# EAGLE design stickie (EAGLE 7.3.0)
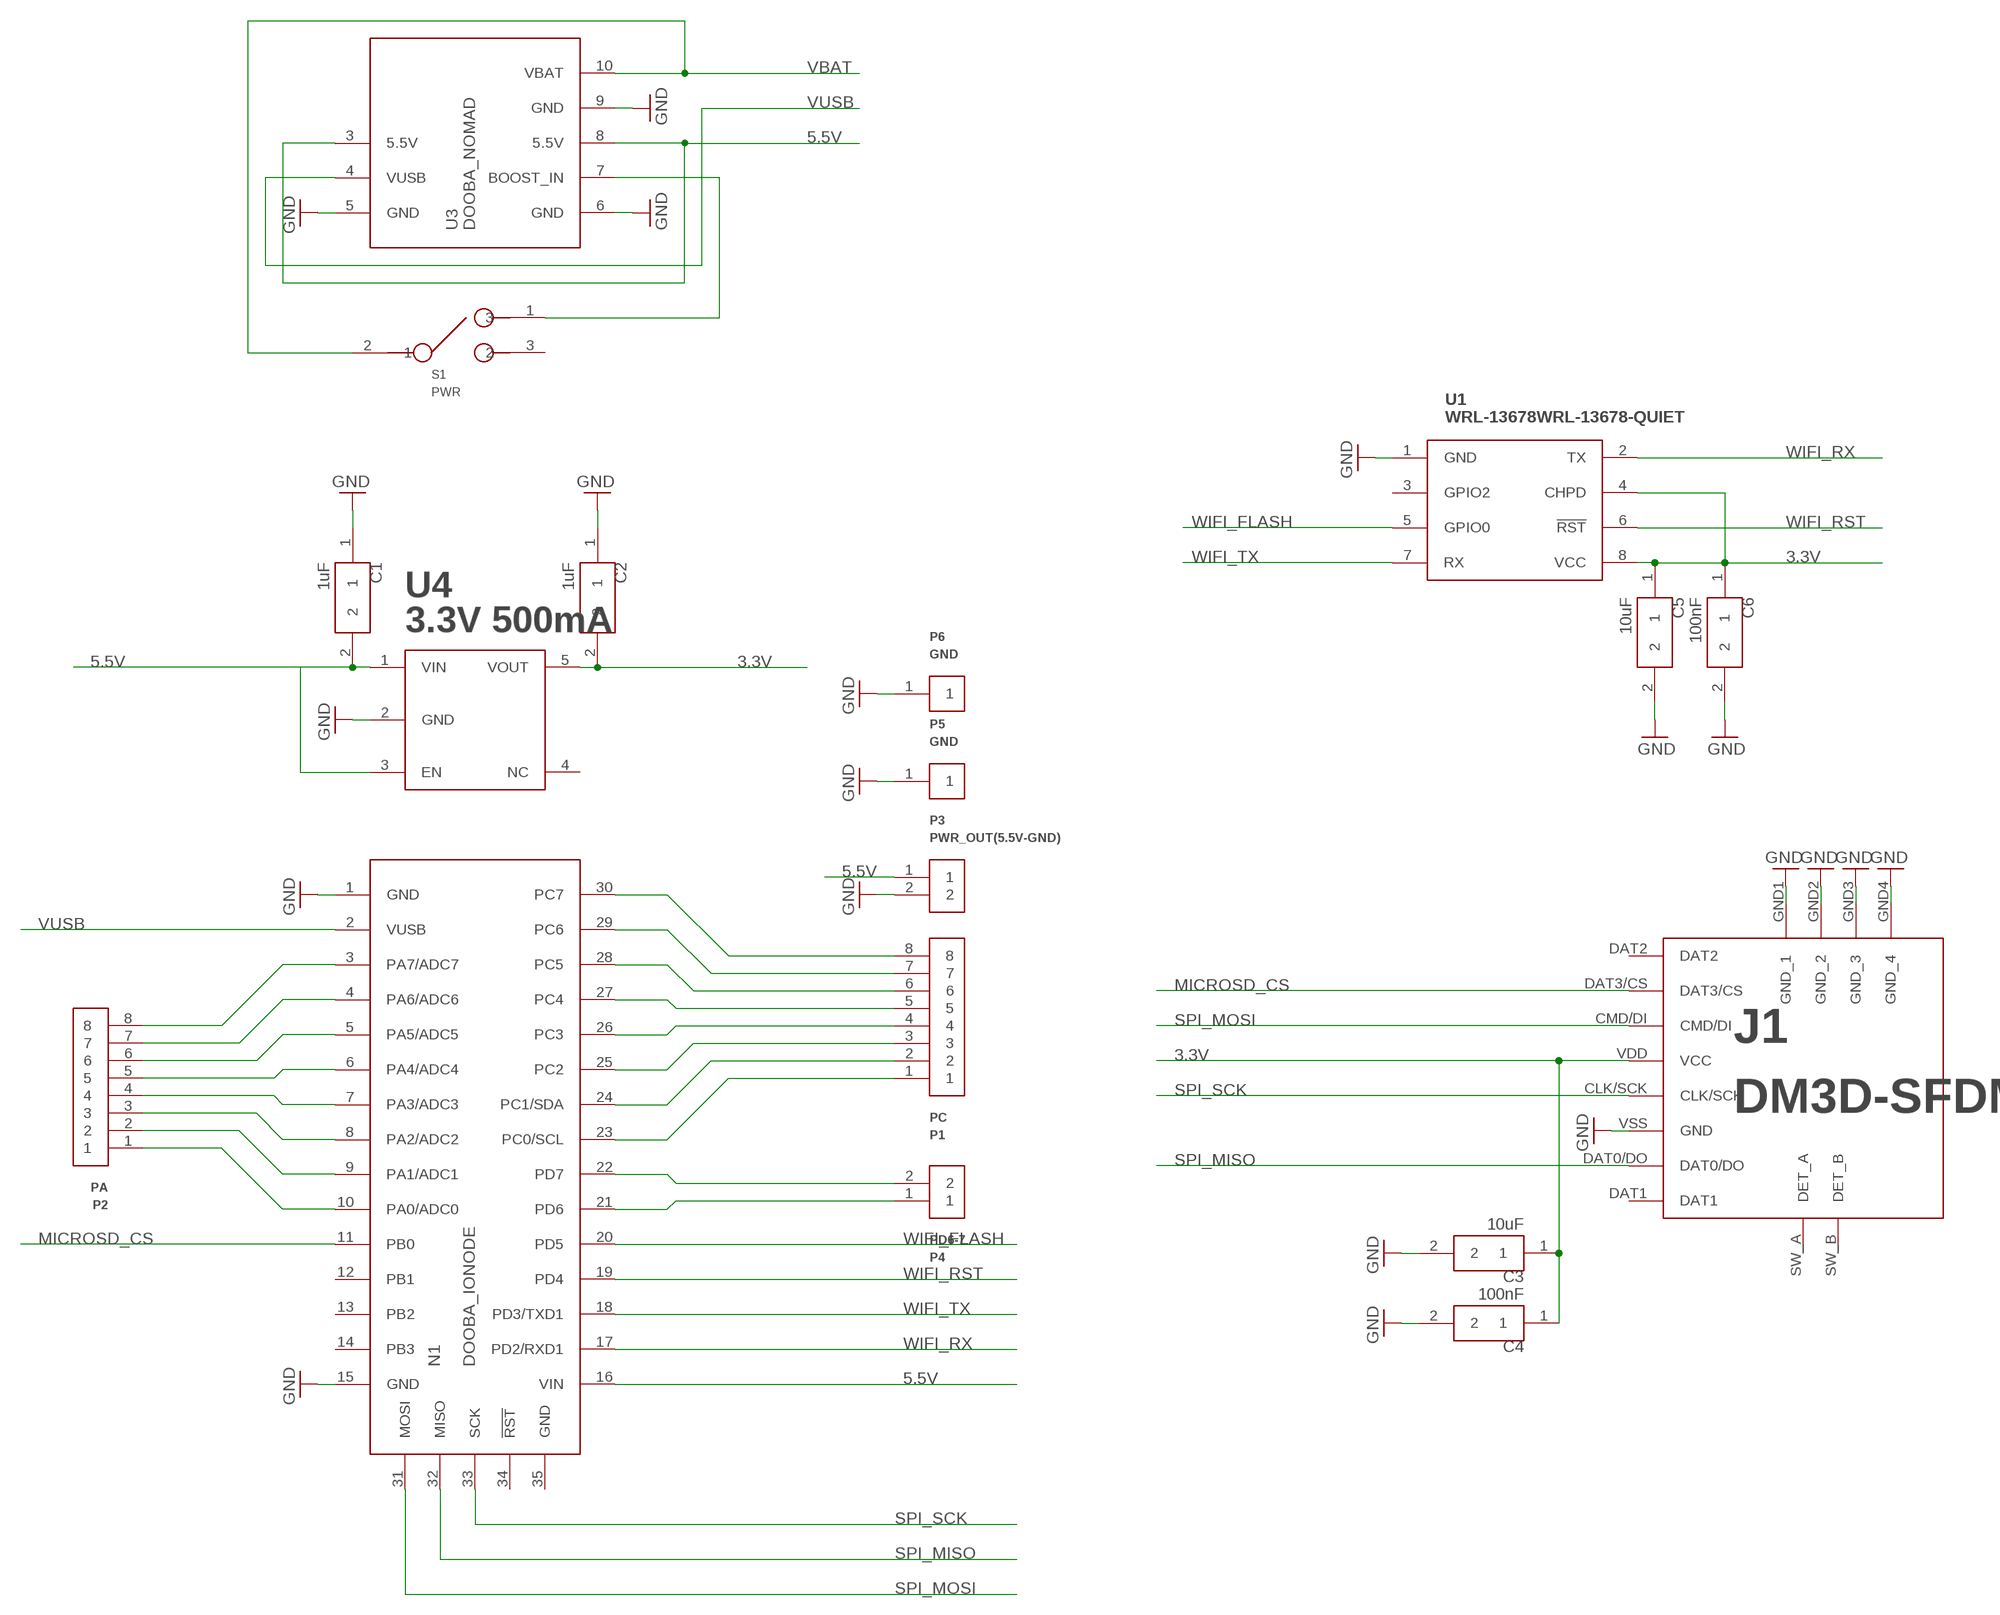
[diagram p0: schematic, sheet 1]

## Parts
C1  1uF  CAP0805  [0805]
C2  1uF  CAP0805  [0805]
C3  10uF  CAP0805  [0805]
C4  100nF  CAP0805  [0805]
C5  10uF  CAP0805  [0805]
C6  100nF  CAP0805  [0805]
J1  DM3D-SFDM  [DM3D-SF]
N1  DOOBA_IONODE  [DOOBA_IONODE]
P1  PC  PIN_8  [PIN_8]
P2  PA  PIN_8  [PIN_8]
P3  PWR_OUT(5.5V-GND)  PIN_2  [PIN_2]
P4  PD6-7  PIN_2  [PIN_2]
P5  GND  PIN_1  [PIN_1]
P6  GND  PIN_1  [PIN_1]
S1  PWR  SWITCH_SPDT  [JS102011]
U1  WRL-13678WRL-13678-QUIET  [WRL-13678-QUIET]
U3  DOOBA_NOMAD  [DOOBA_NOMAD]
U4  3.3V 500mA  LP3985SOT23-5  [SOT23-5]

## Nets
3.3V: C2.2 C3.1 C4.1 C5.1 C6.1 J1.VDD(VCC) U1.4(CHPD) U1.8(VCC) U4.5(VOUT)
5.5V: C1.2 N1.16(VIN) P3.1 U3.3(5.5V) U3.8(5.5V) U4.1(VIN) U4.3(EN)
GND: C1.1 C2.1 C3.2 C4.2 C5.2 C6.2 J1.GND1(GND_1) J1.GND2(GND_2) J1.GND3(GND_3) J1.GND4(GND_4) J1.VSS(GND) N1.1(GND) N1.15(GND) P3.2 P5.1 P6.1 U1.1(GND) U3.5(GND) U3.6(GND) U3.9(GND) U4.2(GND)
MICROSD_CS: J1.DAT3/CS N1.11(PB0)
N$1: N1.23(PC0/SCL) P1.1
N$2: N1.24(PC1/SDA) P1.2
N$3: N1.25(PC2) P1.3
N$4: N1.26(PC3) P1.4
N$5: N1.27(PC4) P1.5
N$6: N1.28(PC5) P1.6
N$7: N1.29(PC6) P1.7
N$8: N1.30(PC7) P1.8
N$9: N1.10(PA0/ADC0) P2.1
N$10: N1.9(PA1/ADC1) P2.2
N$11: S1.1 U3.7(BOOST_IN)
N$12: N1.8(PA2/ADC2) P2.3
N$13: N1.7(PA3/ADC3) P2.4
N$14: N1.6(PA4/ADC4) P2.5
N$15: N1.5(PA5/ADC5) P2.6
N$16: N1.4(PA6/ADC6) P2.7
N$17: N1.3(PA7/ADC7) P2.8
N$18: N1.22(PD7) P4.2
N$19: N1.21(PD6) P4.1
SPI_MISO: J1.DAT0/DO N1.32(MISO)
SPI_MOSI: J1.CMD/DI N1.31(MOSI)
SPI_SCK: J1.CLK/SCK N1.33(SCK)
VBAT: S1.2 U3.10(VBAT)
VUSB: N1.2(VUSB) U3.4(VUSB)
WIFI_FLASH: N1.20(PD5) U1.5(GPIO0)
WIFI_RST: N1.19(PD4) U1.6(!RST)
WIFI_RX: N1.17(PD2/RXD1) U1.2(TX)
WIFI_TX: N1.18(PD3/TXD1) U1.7(RX)
Unconnected: J1.DAT1 J1.DAT2 J1.SW_A(DET_A) J1.SW_B(DET_B) N1.12(PB1) N1.13(PB2) N1.14(PB3) N1.34(!RST) N1.35(GND) S1.3 U1.3(GPIO2) U4.4(NC)

## Library data of the parts
C1-C6 = dooba:CAP
J1 = dooba:DM3D-SF
N1 = dooba:DOOBA_IONODE
P1 P2 = dooba:PIN_8
P3 P4 = dooba:PIN_2
P5 P6 = dooba:PIN_1
S1 = dooba:SWITCH_SPDT
U1 = dooba:WRL-13678
U3 = dooba:DOOBA_NOMAD
U4 = dooba:LP3985

## Board
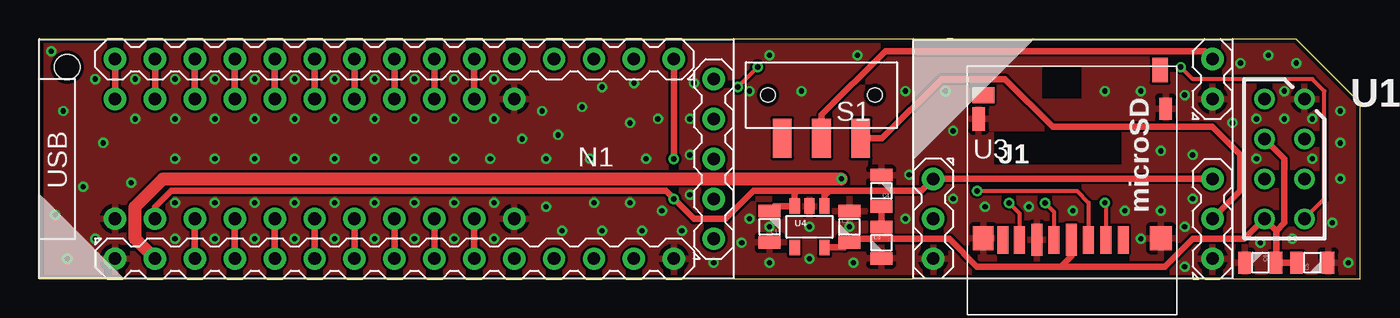
[diagram p1: board, top side]
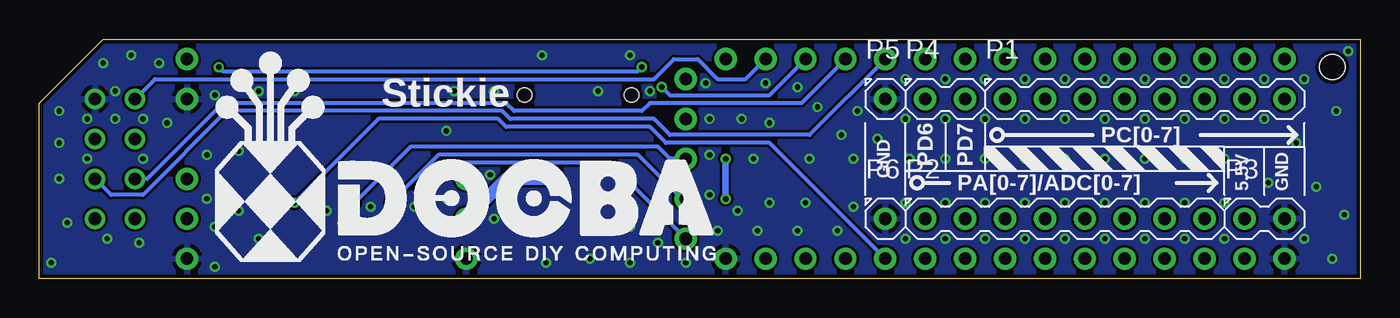
[diagram p2: board, bottom side, seen from below]

Size 84.07 x 15.23 mm. Coordinates in mm from the lower left corner, seen from the top.
Outline: 0,0 84.07,0 84.07,11.17 80.01,15.23 0,15.23 0,0
Copper layers (1*16): Top 0.035mm / dielectric 1.5mm / Bottom 0.035mm
Design rules "dooba": minimum track width 6mil, minimum drill 12mil, track to track 6mil, track to pad 6mil, pad to pad 6mil, via to via 6mil, smd to smd 0mil, copper to edge 10mil, drill to drill 10mil, minimum pad ring 10mil, minimum via ring 6mil, stop-mask expansion 2mil, vias tented up to drill 25mil, thermal gap 10mil
Holes 1.6 mm at 1.78,13.46

### Footprints (pad centres in the part's own frame; a part is rotated, then mirrored left to right if it is on the bottom)
0805 = smd 0.8 x 1.4: 1 -1,0; 2 1,0
DM3D-SF = smd 0.7 x 1.75: CLK/SCK -1.2,-1.34; CMD/DI 1,-1.34; DAT0/DO -3.4,-1.34; DAT1 -4.45,-1.34; DAT2 3.2,-1.34; DAT3/CS 2.1,-1.34 | smd 0.8 x 1.5: GND1 -6,6.36 | smd 0.8 x 1.4: GND2 5.9,7.01 | smd 1.4 x 1.5: GND3 5.6,-1.24 | smd 1.3 x 1.5: GND4 -5.7,-1.24 | smd 1 x 1.55: SW_A 5.55,9.46 | smd 1.4 x 1: SW_B -5.7,7.86 | smd 0.7 x 2.032: VDD -0.1,-1.34; VSS -2.3,-1.34
DOOBA_IONODE = drill 0.8 pad 1.422: 1 16.51,6.35; 2 13.97,6.35; 3 11.43,6.35; 4 8.89,6.35; 5 6.35,6.35; 6 3.81,6.35; 7 1.27,6.35; 8 -1.27,6.35; 9 -3.81,6.35; 10 -6.35,6.35; 11 -8.89,6.35; 12 -11.43,6.35; 13 -13.97,6.35; 14 -16.51,6.35; 15 -19.05,6.35; 16 -19.05,-6.35; 17 -16.51,-6.35; 18 -13.97,-6.35; 19 -11.43,-6.35; 20 -8.89,-6.35; 21 -6.35,-6.35; 22 -3.81,-6.35; 23 -1.27,-6.35; 24 1.27,-6.35; 25 3.81,-6.35; 26 6.35,-6.35; 27 8.89,-6.35; 28 11.43,-6.35; 29 13.97,-6.35; 30 16.51,-6.35; 31 -21.59,5.08; 32 -21.59,2.54; 33 -21.59,0; 34 -21.59,-2.54; 35 -21.59,-5.08
PIN_8 = drill 0.8 pad 1.422: 1 -8.89,0; 2 -6.35,0; 3 -3.81,0; 4 -1.27,0; 5 1.27,0; 6 3.81,0; 7 6.35,0; 8 8.89,0
PIN_2 = drill 0.8 pad 1.422: 1 -1.27,0; 2 1.27,0
PIN_1 = drill 0.8 pad 1.422: 1 0,0
JS102011 = smd 1.2 x 2.5: 1 -2.5,2.75; 2 0,2.75; 3 2.5,2.75 | hole 0.9: -3.4,0; 3.4,0
WRL-13678-QUIET = drill 0.8: 1 -8.89,3.81; 2 -11.43,3.81; 3 -8.89,1.27; 4 -11.43,1.27; 5 -8.89,-1.27; 6 -11.43,-1.27; 7 -8.89,-3.81; 8 -11.43,-3.81
DOOBA_NOMAD = drill 0.8 pad 1.422: 3 -8.89,-1.27; 4 -8.89,-3.81; 5 -8.89,-6.35; 6 8.89,-6.35; 7 8.89,-3.81; 8 8.89,-1.27; 9 8.89,3.81; 10 8.89,6.35
SOT23-5 = smd 0.66 x 1: 1 0.95,1.315; 2 0,1.315; 3 -0.95,1.315; 4 -0.95,-1.315; 5 0.95,-1.315

### Placement (x,y rotation side)
C1  46.48,3.3 90 top
C2  51.56,3.3 270 top
C3  53.59,2.29 270 top
C4  53.59,5.59 90 top
C5  81.03,1.02 0 top
C6  77.72,1.02 180 top
J1  65.79,3.81 0 top
N1  21.34,7.62 180 top
P1  13.72,11.43 0 bottom
P2  18.8,3.81 0 bottom
P3  6.1,3.81 0 bottom
P4  26.42,11.43 0 bottom
P5  30.23,11.43 0 bottom
P6  30.23,3.81 0 bottom
S1  49.78,11.68 180 top
U1  89.41,7.62 0 top
U3  65.79,7.62 0 top
U4  49.02,3.3 0 top

### Tracks (layer width: path | path; a pad name or v marks a point on that pad's centre or on a via)
3.3V
  Top 0.406: U4.5 51.25,1.99 C2.2 51.8,2.54 54.34,2.54 | 54.34,2.54 57.91,2.54 59.69,0.76 65.02,0.76 | 65.02,0.76 65.69,1.42 J1.VDD | C4.1 C3.1 54.34,2.54 | 78.72,3.06 U1.8 76.71,2.54 73.41,2.54 71.63,0.76 65.02,0.76 | 78.72,3.06 C6.1 C5.1 | U1.4 79.25,7.62 79.25,3.56 78.76,3.06 78.72,3.06
5.5V  (via drill 0.36)
  Top 0.406: 50.29,5.59 56.13,5.59 U3.3 U3.8 | 50.29,5.59 49.97,5.27 U4.1 | C1.2 46.8,4.62 U4.3 48.07,5.4 48.26,5.59 | 48.26,5.59 50.29,5.59 | P3.1 7.37,4.57 8.38,5.59 39.88,5.59 v40.39,5.08 41.66,3.81 43.69,3.81 45.47,5.59 48.26,5.59 | v40.39,7.62 N1.16
  Bottom 0.406: v40.39,5.08 v40.39,7.62
GND  (via drill 0.33)
  other vias: 8.64,2.54 11.18,2.54 13.72,2.54 16.26,2.54 18.8,2.54 21.34,2.54 23.88,2.54 26.42,2.54 28.96,2.54 6.1,12.7 8.64,12.7 11.18,12.7 13.72,12.7 16.26,12.7 18.8,12.7 21.34,12.7 23.88,12.7 26.42,12.7 28.96,12.7 32.26,4.57 28.96,4.83 32,10.67 33.27,3.05 35.81,3.05 38.35,3.05 40.89,3.05 38.61,7.62 41.4,7.87 45.21,3.81 42.93,1.02 46.48,1.02 44.7,2.29 49.02,3.3 51.82,1.02 49.02,1.27 37.59,9.91 35.05,7.62 33.02,9.14 28.96,10.16 34.54,10.92 35.81,12.19 37.59,4.83 45.21,11.94 48.51,11.94 52.07,14.22 46.48,14.22 55.37,6.6 55.12,3.81 51.56,3.3 46.48,3.3 55.12,11.94 57.66,11.94 67.82,11.94 71.37,8.13 58.17,5.08 60.2,4.57 65.79,4.32 69.09,4.32 70.1,2.54 71.37,4.32 73.41,5.08 72.9,11.68 32.26,7.62 28.7,7.62 26.42,7.62 23.88,7.62 21.34,7.62 18.8,7.62 8.64,7.62 5.84,6.1 8.64,4.83 11.18,4.83 13.72,4.83 16.26,4.83 18.8,4.83 21.34,4.83 23.88,4.83 26.42,4.83 11.18,7.62 13.72,7.62 16.26,7.62 6.1,10.16 8.64,10.16 11.18,10.16 13.72,10.16 16.26,10.16 18.8,10.16 21.34,10.16 23.88,10.16 26.42,10.16 3.56,12.7 3.56,2.54 4.06,8.64 2.79,5.84 1.52,10.67 1.02,4.06 1.78,1.27 0.76,14.48 72.9,0.76 72.9,3.3 73.41,7.87 75.95,9.91 79.25,10.16 81.03,7.62 77.47,7.62 77.47,10.16 81.03,10.16 79.25,11.94 77.72,2.29 79.76,2.54 82.3,3.56 80.01,13.72 76.45,13.72 78.23,14.22 82.8,10.67 82.8,8.64 83.31,1.02 82.8,6.35 30.73,8.89 58.17,9.4 62.99,4.57 70.1,11.94 37.85,12.45 35.31,4.83 39.62,4.32 41.4,5.33 41.4,10.16 41.66,12.45 39.37,10.16
  pour Top (isolate 0.012): 0,15.24 84.07,15.24 84.07,0 0,0
  pour Bottom (isolate 0.012): 0,15.24 84.07,15.24 84.07,0 0,0
MICROSD_CS  (via drill 0.33)
  Top 0.254: v67.82,4.83 67.89,4.76 J1.DAT3/CS
  Bottom 0.254: N1.11 37.59,8.64 44.2,8.64 45.21,9.65 54.36,9.65 54.86,10.16 62.48,10.16 v67.82,4.83
N$1
  Top 0.406: N1.23 P1.1
N$2
  Top 0.406: N1.24 P1.2
N$3
  Top 0.406: N1.25 P1.3
N$4
  Top 0.406: N1.26 P1.4
N$5
  Top 0.406: N1.27 P1.5
N$6
  Top 0.406: N1.28 P1.6
N$7
  Top 0.406: N1.29 P1.7
N$8
  Top 0.406: N1.30 P1.8
N$9
  Top 0.406: P2.1 N1.10
N$10
  Top 0.406: P2.2 N1.9
N$11
  Top 0.406: U3.7 76.45,5.59 76.45,7.87 74.68,9.65 64.52,9.65 61.47,12.7 57.4,12.7 53.64,8.93 S1.1
N$12
  Top 0.406: P2.3 N1.8
N$13
  Top 0.406: P2.4 N1.7
N$14
  Top 0.406: P2.5 N1.6
N$15
  Top 0.406: P2.6 N1.5
N$16
  Top 0.406: P2.7 N1.4
N$17
  Top 0.406: P2.8 N1.3
N$18
  Top 0.406: N1.22 P4.2
N$19
  Top 0.406: N1.21 P4.1
SPI_MISO  (via drill 0.36)
  Top 0.254: v61.72,4.83 62.39,4.16 J1.DAT0/DO
  Bottom 0.254: v61.72,4.83 58.67,7.87 45.97,7.87 43.18,5.08 N1.32
SPI_MOSI  (via drill 0.36)
  Top 0.254: v59.69,5.59 66.04,5.59 66.79,4.84 J1.CMD/DI
  Bottom 0.254: N1.31 47.75,7.37 57.91,7.37 v59.69,5.59
SPI_SCK  (via drill 0.36)
  Top 0.254: v64.01,4.83 64.59,4.25 J1.CLK/SCK
  Bottom 0.254: v64.01,4.83 60.45,8.38 44.7,8.38 43.94,7.62 N1.33
VBAT
  Top 0.406: U3.10 74.17,14.48 53.85,14.48 49.78,10.41 S1.2
VUSB  (via drill 0.33)
  Top 0.813: N1.2 6.1,2.54 6.1,4.57 7.87,6.35 v51.05,6.35
  Bottom 0.813: v51.05,6.35 54.36,6.35 U3.4
WIFI_FLASH
  Bottom 0.254: N1.20 35.05,9.14 43.94,9.14 44.96,10.16 54.1,10.16 54.61,10.67 72.14,10.67 77.47,5.33 79.5,5.33 U1.5
WIFI_RST
  Bottom 0.254: N1.19 35.56,11.18 45.21,11.18 45.72,10.67 53.85,10.67 54.36,11.18 72.39,11.18 77.22,6.35 U1.6
WIFI_RX
  Bottom 0.254: U1.2 76.71,12.7 44.96,12.7 43.69,13.97 42.16,13.97 40.89,12.7 39.12,12.7 N1.17
WIFI_TX  (via drill 0.33, 0.36)
  Top 0.254: U1.7 81.79,5.08 81.79,11.94 81.03,12.7 73.41,12.7 v72.64,13.46 | v45.72,13.46 v44.45,12.19
  Bottom 0.254: v72.64,13.46 72.39,13.21 45.97,13.21 v45.72,13.46 | v44.45,12.19 43.94,11.68 37.59,11.68 N1.18

### Text on the board
bPlace: Stickie | PD7 | PD6 | PC[0-7] | GND | GND | 5.5V | PA[0-7]/ADC[0-7]